# EAGLE design usbpropicprog-v2 (EAGLE 7.2.0)
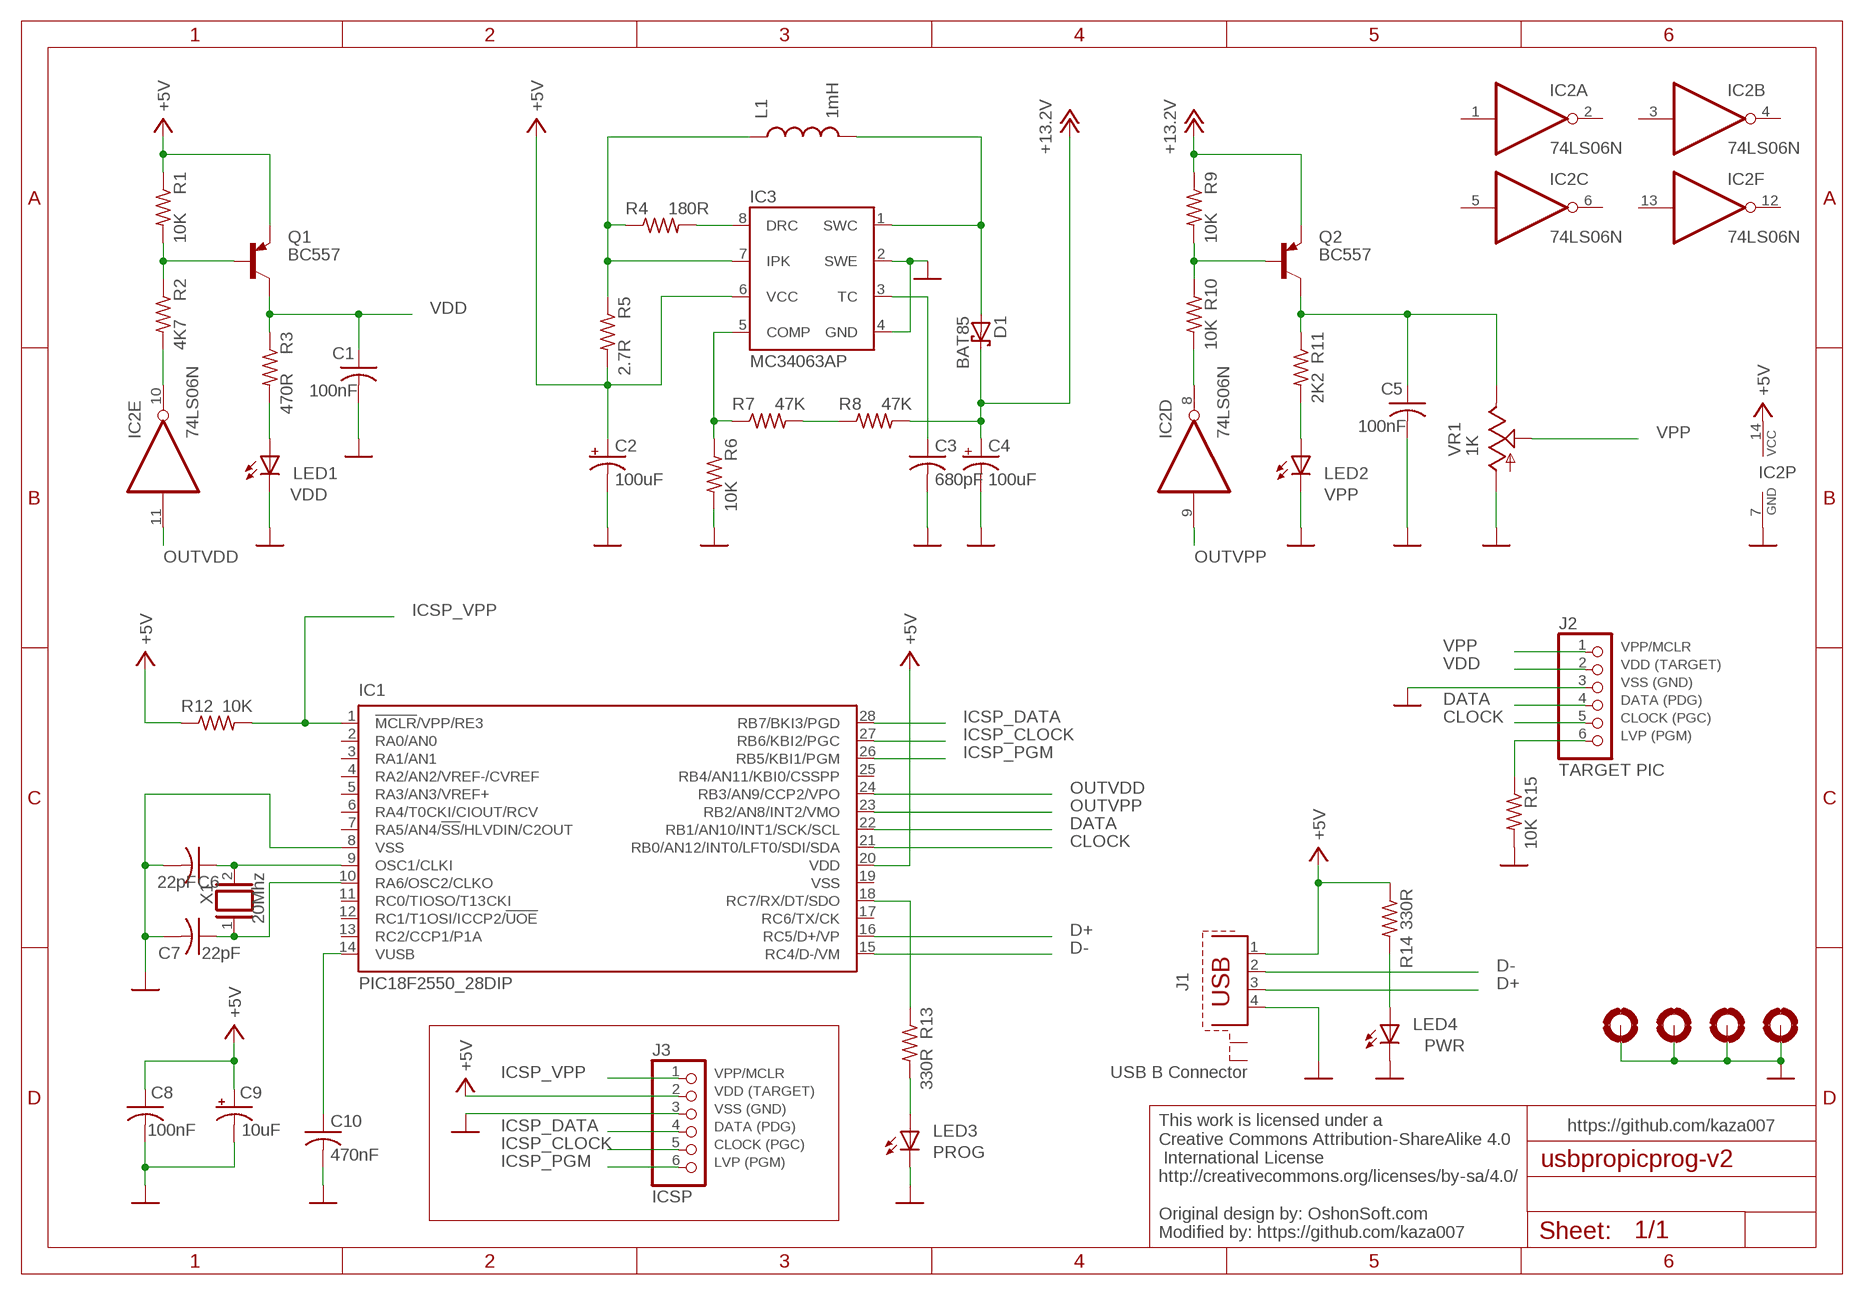
[diagram p0: schematic, sheet 1]

## Parts
C1  100nF  C-US050-025X075  [C050-025X075]
C2  100uF  POL-CAP-USE2,5-6,3  [E2,5-6,3]
C3  680pF  C-US050-025X075  [C050-025X075]
C4  100uF  POL-CAP-USE2,5-6,3  [E2,5-6,3]
C5  100nF  C-US050-025X075  [C050-025X075]
C6  22pF  C-US025-024X044  [C025-024X044]
C7  22pF  C-US025-024X044  [C025-024X044]
C8  100nF  C-US050-025X075  [C050-025X075]
C9  10uF  CPOL-USE2-5  [E2-5]
C10  470nF  C-US050-035X075  [C050-035X075]
D1  BAT85  1N5819-T  [DO41-7.6]
H1  MOUNT-PAD-ROUND2.8  [2,8-PAD]
H2  MOUNT-PAD-ROUND2.8  [2,8-PAD]
H3  MOUNT-PAD-ROUND2.8  [2,8-PAD]
H4  MOUNT-PAD-ROUND2.8  [2,8-PAD]
IC1  PIC18F2550_28DIP  [DIL28-3]
IC2  74LS06N  [DIL14]
IC3  MC34063AP  [DIL-08]
J1  USB B Connector  PN61729-S  [PN61729-S]
J2  TARGET PIC  PINHD-1X6  [1X06]
J3  ICSP  PINHD-1X6  [1X06]
L1  1mH  INDUCTORRLB0912  [RLB0912]
LED1  VDD  LED5MM  [LED5MM]
LED2  VPP  LED5MM  [LED5MM]
LED3  PROG  LED5MM  [LED5MM]
LED4  PWR  LED5MM  [LED5MM]
Q1  BC557  [TO92-EBC]
Q2  BC557  [TO92-EBC]
R1  10K  R-US_0207/10  [0207/10]
R2  4K7  R-US_0207/10  [0207/10]
R3  470R  R-US_0207/10  [0207/10]
R4  180R  R-US_0207/10  [0207/10]
R5  2.7R  R-US_0207/10  [0207/10]
R6  10K  R-US_0207/10  [0207/10]
R7  47K  R-US_0207/10  [0207/10]
R8  47K  R-US_0207/10  [0207/10]
R9  10K  R-US_0207/10  [0207/10]
R10  10K  R-US_0207/10  [0207/10]
R11  2K2  R-US_0207/10  [0207/10]
R12  10K  R-US_0207/10  [0207/10]
R13  330R  R-US_0207/10  [0207/10]
R14  330R  R-US_0207/10  [0207/10]
R15  10K  R-US_0207/10  [0207/10]
VR1  1K  R-TRIMM_US  [R-TRIMMT93YA]
X1  20Mhz  XTAL/S  [QS]

## Nets
+5V: C2.+ C8.1 C9.+ IC1.20(VDD) IC2.14(P:VCC) IC3.6(VCC) J1.1 J3.2 Q1.E R1.1 R5.2 R12.1 R14.1
+12V: C4.+ D1.C Q2.E R8.2 R9.1 ; supply symbol labelled +13.2V
CLOCK: IC1.21(RB0/AN12/INT0/LFT0/SDI/SDA) J2.5
D+: IC1.16(RC5/D+/VP) J1.3
D-: IC1.15(RC4/D-/VM) J1.2
DATA: IC1.22(RB1/AN10/INT1/SCK/SCL) J2.4
GND: C1.2 C2.- C3.2 C4.- C5.2 C6.2 C7.2 C8.2 C9.- C10.2 H1.B2,8(MOUNT) H2.B2,8(MOUNT) H3.B2,8(MOUNT) H4.B2,8(MOUNT) IC1.8(VSS) IC2.7(P:GND) IC3.2(SWE) IC3.4(GND) J1.4 J2.3 J3.3 LED1.K(C) LED2.K(C) LED3.K(C) LED4.K(C) R6.2 R15.2 VR1.3(A)
ICSP_CLOCK: IC1.27(RB6/KBI2/PGC) J3.5
ICSP_DATA: IC1.28(RB7/BKI3/PGD) J3.4
ICSP_PGM: IC1.26(RB5/KBI1/PGM) J3.6
ICSP_VPP: IC1.1(!MCLR!/VPP/RE3) J3.1 R12.2
N$1: IC1.18(RC7/RX/DT/SDO) R13.1
N$2: LED3.A R13.2
N$3: R7.2 R8.1
N$5: J2.6 R15.1
N$6: LED4.A R14.2
N$14: Q1.B R1.2 R2.1
N$15: Q2.B R9.2 R10.1
N$16: IC3.8(DRC) R4.2
N$17: LED1.A R3.2
N$18: IC3.7(IPK) L1.1 R4.1 R5.1
N$19: IC2.10(E:O) R2.2
N$20: LED2.A R11.2
N$21: C6.1 IC1.9(OSC1/CLKI) X1.2
N$22: C10.1 IC1.14(VUSB)
N$23: IC2.8(D:O) R10.2
N$25: D1.A IC3.1(SWC) L1.2
N$28: C3.1 IC3.3(TC)
N$29: IC3.5(COMP) R6.1 R7.1
N$34: C7.1 IC1.10(RA6/OSC2/CLKO) X1.1
OUTVDD: IC1.24(RB3/AN9/CCP2/VPO) IC2.11(E:I)
OUTVPP: IC1.23(RB2/AN8/INT2/VMO) IC2.9(D:I)
VDD: C1.1 J2.2 Q1.C R3.1
VPP: J2.1 VR1.2(S)
VPPHIGH: C5.1 Q2.C R11.1 VR1.1(E)
Unconnected: IC1.2(RA0/AN0) IC1.3(RA1/AN1) IC1.4(RA2/AN2/VREF-/CVREF) IC1.5(RA3/AN3/VREF+) IC1.6(RA4/T0CKI/CIOUT/RCV) IC1.7(RA5/AN4/!SS!/HLVDIN/C2OUT) IC1.11(RC0/TIOSO/T13CKI) IC1.12(RC1/T1OSI/ICCP2/!UOE) IC1.13(RC2/CCP1/P1A) IC1.17(RC6/TX/CK) IC1.25(RB4/AN11/KBI0/CSSPP) IC2.1(A:I) IC2.2(A:O) IC2.3(B:I) IC2.4(B:O) IC2.5(C:I) IC2.6(C:O) IC2.12(F:O) IC2.13(F:I) J1.S1 J1.S2

## Notes on the sheet
- VPP/MCLR
- VDD (TARGET)
- VSS (GND)
- DATA (PDG)
- CLOCK (PGC)
- LVP (PGM)
- VPP/MCLR
- VDD (TARGET)
- VSS (GND)
- DATA (PDG) | https://github.com/kaza007
- CLOCK (PGC)
- LVP (PGM)
- This work is licensed under a 
  Creative Commons Attribution-ShareAlike 4.0
   International License
  http://creativecommons.org/licenses/by-sa/4.0/
  
  Original design by: OshonSoft.com
  Modified by: https://github.com/kaza007

## Power pins joined to a net without a drawn wire
VSS: IC1.19(VSS)

## Library data of the parts
C1 C3 C5-C8 C10 = rcl:C-US: CAPACITOR, American symbol
C2 C4 = arthur:POL-CAP-US
C9 = rcl:CPOL-US: POLARIZED CAPACITOR, American symbol
D1 = diode:1N581*: 1.0A SCHOTTKY BARRIER RECTIFIER Source: http://www.diodes.com/datasheets/ds23001.pdf
H1-H4 = holes:MOUNT-PAD-ROUND: MOUNTING PAD, round
IC1 = microchip:PIC18F2*_28: USB Microcontrollers with nanoWatt Technology High-Performance, Enhanced Flash, 28/40/44-Pin, Source: http://ww1.microchip.com/downloads/en/devicedoc/39632c.pdf; MF: MICROCHIP; MPN: PIC18F2550-I/SP; OC_FARNELL: 1523822; OC_NEWARK: 80K6054
IC2 = 74xx-eu:74*06: Hex INVERTER, open collector high-voltage output
IC3 = v-reg-3:MC34063A: 1.5A Step-Up/Down/Inverting Switching Regulator NPN Darlington Switch, Vin 3V to 40V, Current Limiter Input, adjustable Frequency up to 100kHz
J1 = con-berg:PN61729-S: BERG USB connector; OC_FARNELL: unknown; OC_NEWARK: unknown
J2 J3 = pinhead:PINHD-1X6: PIN HEADER
L1 = kaza007:INDUCTOR: Inductors Basic Inductor/Choke - 0603 and 1206. Footprints are not proven and vary greatly between part numbers.
LED1-LED4 = led:LED: LED OSRAM: - CHIPLED LG R971, LG N971, LY N971, LG Q971, LY Q971, LO R971, LY R971 LH N974, LH R974 LS Q976, LO Q976, LY Q976 LO Q996 - Hyper CHIPLED LW Q18S LB Q993, LB Q99A, LB R99A - SideLED LS A670, LO A670, LY A670, LG A670, LP A670 LB A673, LV A673, LT A673, LW A673 LH A674 LY A675 LS A676, LA A676, LO A676, LY A676, LW A676 LS A679, LY A679, LG A679 - Hyper Micro SIDELED® LS Y876, LA Y876, LO Y876, LY Y876 LT Y87S - SmartLED LW L88C, LW L88S LB L89C, LB L89S, LG L890 LS L89K, LO L89K, LY L89K LS L896, LA L896, LO L896, LY L896 - TOPLED LS T670, LO T670, LY T670, LG T670, LP T670 LSG T670, LSP T670, LSY T670, LOP T670, LYG T670 LG T671, LOG T671, LSG T671 LB T673, LV T673, LT T673, LW T673 LH T674 LS T676, LA T676, LO T676, LY T676, LB T676, LH T676, LSB T676, LW T676 LB T67C, LV T67C, LT T67C, LS T67K, LO T67K, LY T67K, LW E67C LS E67B, LA E67B, LO E67B, LY E67B, LB E67C, LV E67C, LT E67C LW T67C LS T679, LY T679, LG T679 LS T770, LO T770, LY T770, LG T770, LP T770 LB T773, LV T773, LT T773, LW T773 LH T774 LS E675, LA E675, LY E675, LS T675 LS T776, LA T776, LO T776, LY T776, LB T776 LHGB T686 LT T68C, LB T68C - Hyper Mini TOPLED® LB M676 - Mini TOPLED Santana® LG M470 LS M47K, LO M47K, LY M47K Source: http://www.osram.convergy.de LUXEON: - LUMILED® LXK2-PW12-R00, LXK2-PW12-S00, LXK2-PW14-U00, LXK2-PW14-V00 LXK2-PM12-R00, LXK2-PM12-S00, LXK2-PM14-U00 LXK2-PE12-Q00, LXK2-PE12-R00, LXK2-PE12-S00, LXK2-PE14-T00, LXK2-PE14-U00 LXK2-PB12-K00, LXK2-PB12-L00, LXK2-PB12-M00, LXK2-PB14-N00, LXK2-PB14-P00, LXK2-PB14-Q00 LXK2-PR12-L00, LXK2-PR12-M00, LXK2-PR14-Q00, LXK2-PR14-R00 LXK2-PD12-Q00, LXK2-PD12-R00, LXK2-PD12-S00 LXK2-PH12-R00, LXK2-PH12-S00 LXK2-PL12-P00, LXK2-PL12-Q00, LXK2-PL12-R00 Source: www.luxeon.com KINGBRIGHT: KA-3528ASYC Source: www.kingbright.com
Q1 Q2 = transistor-pnp:BC557*: PNP Transistror
R1-R15 = resistor:R-US_: RESISTOR, American symbol
VR1 = arthur:R-TRIMM_US: R-TRIMMER Block Trimmer with adjustment screw on top.
X1 = special:XTAL/S: CRYSTAL

## Board
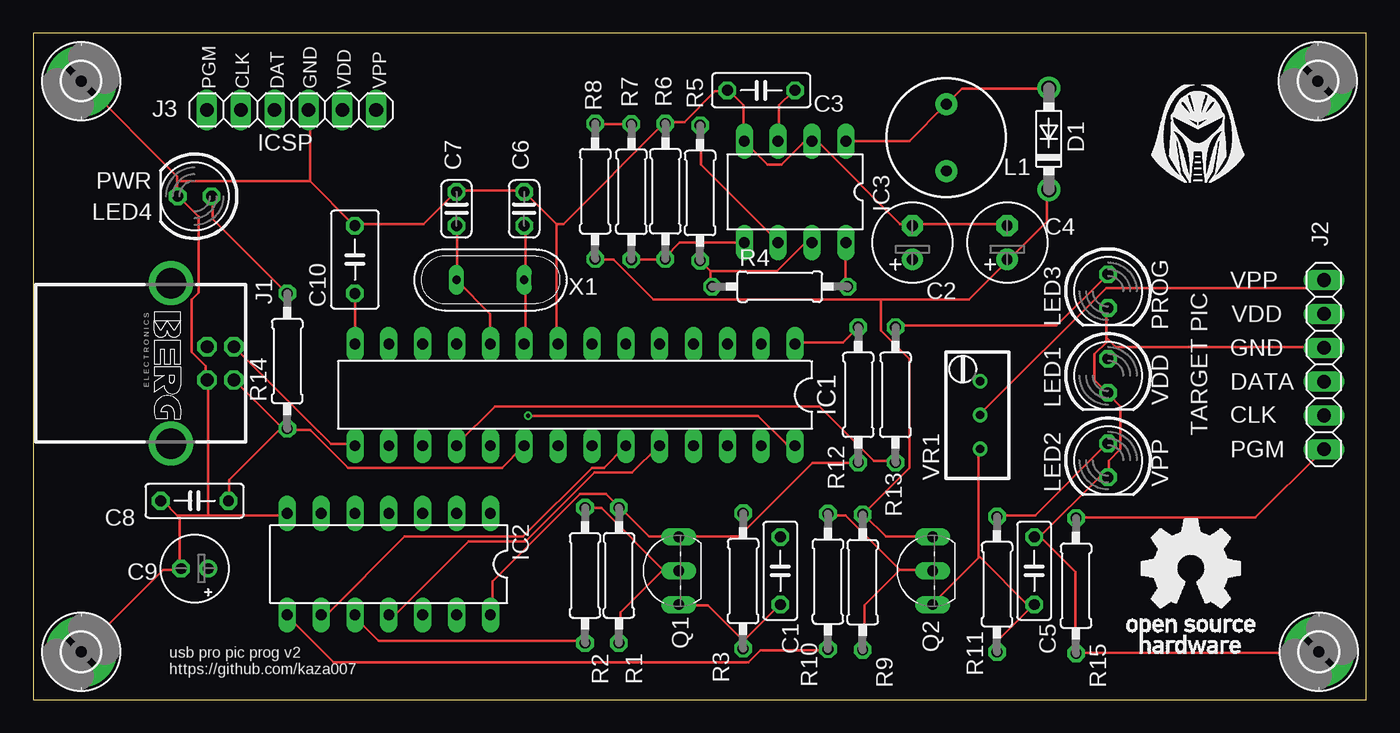
[diagram p1: board, top side]
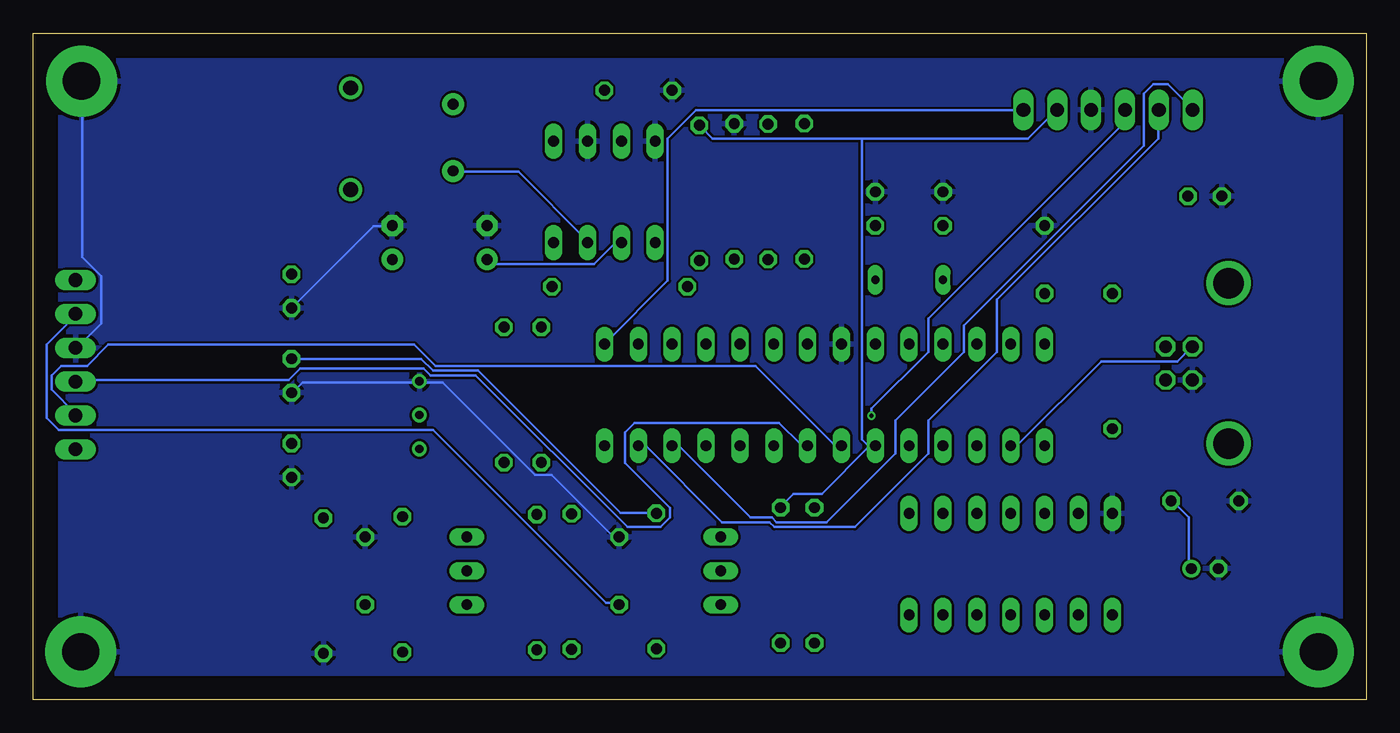
[diagram p2: board, bottom side, seen from below]

Size 100 x 50 mm. Coordinates in mm from the lower left corner, seen from the top.
Outline: 0,0 100,0 100,50 0,50 0,0
Copper layers (1*16): Top 0.035mm / dielectric 1.5mm / Bottom 0.035mm
Design rules "ShenZhen2U EagleRules": minimum track width 7mil, minimum drill 12mil, track to track 7mil, track to pad 7mil, pad to pad 7mil, via to via 7mil, smd to smd 0mil, copper to edge 20mil, drill to drill 10mil, minimum pad ring 10mil, minimum via ring 6mil, stop-mask expansion 2mil, vias tented up to drill 25mil, thermal gap 10mil

### Footprints (pad centres in the part's own frame; a part is rotated, then mirrored left to right if it is on the bottom)
C050-025X075 = drill 0.813 octagon: 1 -2.54,0; 2 2.54,0
E2,5-6,3 = drill 0.813 pad 1.6: + -1.27,0 | drill 0.813 pad 1.6 octagon: - 1.27,0
C025-024X044 = drill 0.813 octagon: 1 -1.27,0; 2 1.27,0
E2-5 = drill 0.813 pad 1.27: + -1.016,0 | drill 0.813 pad 1.27 octagon: - 1.016,0
C050-035X075 = drill 0.813 octagon: 1 -2.54,0; 2 2.54,0
DO41-7.6 = drill 1.1 pad 1.7: A 3.81,0; C -3.81,0
2,8-PAD = drill 2.8 pad 5.334: B2,8 0,0
DIL28-3 = drill 0.813 long: 1 -16.51,-3.81; 2 -13.97,-3.81; 3 -11.43,-3.81; 4 -8.89,-3.81; 5 -6.35,-3.81; 6 -3.81,-3.81; 7 -1.27,-3.81; 8 1.27,-3.81; 9 3.81,-3.81; 10 6.35,-3.81; 11 8.89,-3.81; 12 11.43,-3.81; 13 13.97,-3.81; 14 16.51,-3.81; 15 16.51,3.81; 16 13.97,3.81; 17 11.43,3.81; 18 8.89,3.81; 19 6.35,3.81; 20 3.81,3.81; 21 1.27,3.81; 22 -1.27,3.81; 23 -3.81,3.81; 24 -6.35,3.81; 25 -8.89,3.81; 26 -11.43,3.81; 27 -13.97,3.81; 28 -16.51,3.81
DIL14 = drill 0.813 long: 1 -7.62,-3.81; 2 -5.08,-3.81; 3 -2.54,-3.81; 4 0,-3.81; 5 2.54,-3.81; 6 5.08,-3.81; 7 7.62,-3.81; 8 7.62,3.81; 9 5.08,3.81; 10 2.54,3.81; 11 0,3.81; 12 -2.54,3.81; 13 -5.08,3.81; 14 -7.62,3.81
DIL-08 = drill 0.813 long: 1 -3.81,-3.81; 2 -1.27,-3.81; 3 1.27,-3.81; 4 3.81,-3.81; 5 3.81,3.81; 6 1.27,3.81; 7 -1.27,3.81; 8 -3.81,3.81
PN61729-S = drill 0.95 octagon: 1 1.25,4.71; 2 -1.25,4.71; 3 -1.25,2.71; 4 1.25,2.71 | drill 2.3 pad 2.9: S1 -6.02,0; S2 6.02,0
1X06 = drill 1.016 long: 1 -6.35,0; 2 -3.81,0; 3 -1.27,0; 4 1.27,0; 5 3.81,0; 6 6.35,0
RLB0912 = drill 0.813 pad 1.651: 1 2.502,0; 2 -2.502,0
LED5MM = drill 0.813 octagon: A -1.27,0; K 1.27,0
TO92-EBC = drill 0.813 long: B 0,-1.27; C -2.54,-1.27; E 2.54,-1.27
0207/10 = drill 0.813 octagon: 1 -5.08,0; 2 5.08,0
R-TRIMMT93YA = drill 0.61: 1 0,-2.54; 2 0,0; 3 0,2.54
QS = drill 0.61 long: 1 -2.54,0; 2 2.54,0

### Placement (x,y rotation side)
C1  56.05,9.66 90 top
C2  65.96,34.3 90 top
C3  54.61,45.72 180 top
C4  73.07,34.3 90 top
C5  75.1,9.66 90 top
C6  36.83,36.83 90 top
C7  31.75,36.83 90 top
C8  12.1,14.91 180 top
C9  12.1,9.83 180 top
C10  24.13,33.02 90 top
D1  76.19,42.08 90 top
H1  3.58,46.42 0 top
H2  3.58,3.58 0 top
H3  96.38,46.42 0 top
H4  96.45,3.58 0 top
IC1  40.64,22.86 180 top
IC2  26.67,10.16 180 top
IC3  57.15,38.1 180 top
J1  10.33,25.23 270 top
J2  96.83,25.13 270 top
J3  19.37,44.25 180 top
L1  68.5,42.17 270 top
LED1  80.63,24.3 270 top
LED2  80.63,17.95 270 top
LED3  80.63,30.65 270 top
LED4  12.1,37.77 180 top
Q1  47.16,9.66 90 top
Q2  66.21,9.66 90 top
R1  43.93,9.31 270 top
R2  41.39,9.31 270 top
R3  53.26,8.9 90 top
R4  56.01,30.99 0 top
R5  50.03,38.02 90 top
R6  47.42,38.14 90 top
R7  44.87,38.11 90 top
R8  42.16,38.14 270 top
R9  62.22,8.81 270 top
R10  59.62,8.86 270 top
R11  72.31,8.64 90 top
R12  61.89,22.87 90 top
R13  64.69,22.87 90 top
R14  19.05,25.4 90 top
R15  78.23,8.54 270 top
VR1  71.04,21.34 0 top
X1  34.29,31.5 0 top

### Tracks (layer width: path | path; a pad name or v marks a point on that pad's centre or on a via)
+5V
  Top 0.178: R5.2 50.09,42.99 50.09,40.15 55.78,34.46 IC3.6 | 18.62,20.41 18.98,20.41 R14.1 | 18.62,20.41 15.07,23.96 J1.1 | 18.62,20.41 14.71,16.5 14.71,15.07 C8.1 | 18.62,20.41 R14.1 | IC2.14 34.45,6.36 34.45,8.85 41.03,15.43 42.98,15.43 43.87,14.54 R1.1 44.05,14.36 46.18,12.23 48.32,12.23 Q1.E 48.49,12.23 52.94,12.23 58.45,17.74 61.83,17.74 R12.1 | R14.1 19.16,20.23 20.76,20.23 23.6,17.39 35.16,17.39 36.76,18.99 IC1.20
  Bottom 0.178: IC3.6 55.96,34.28 56.32,34.28 57.92,32.68 65.74,32.68 65.92,32.86 C2.+ | 37.83,42.1 49.03,42.1 49.92,42.99 R5.2 | 37.83,42.1 25.38,42.1 23.25,44.23 J3.2 | C9.+ 13.29,9.92 13.29,13.65 14.53,14.9 C8.1 | 37.29,18.99 36.94,18.99 IC1.20 37.29,18.99 | 37.29,18.99 40.85,15.43 42.98,15.43 43.87,14.54 R1.1 | 37.83,42.1 37.83,19.52 37.29,18.99
+12V
  Top 0.178: Q2.E 67.34,12.23 63.96,12.23 62.36,13.83 R9.1 62.36,14.01 65.74,17.39 65.74,25.57 63.61,27.7 63.61,30.01 | 63.61,30.01 70.18,30.01 73.03,32.86 C4.+ 73.21,33.03 76.05,35.88 76.05,38.19 D1.C | 63.61,30.01 46.54,30.01 43.52,33.03 42.27,33.03 R8.2
CLOCK
  Bottom 0.178: IC1.21 39.43,19.16 39.96,19.16 45.83,25.03 69.83,25.03 71.43,26.63 94.37,26.63 95.97,25.03 97.92,25.03 98.63,24.32 98.63,23.25 96.85,21.48 J2.5
D+
  Bottom 0.178: IC1.16 26.62,19.16 26.09,19.16 19.87,25.39 14.18,25.39 13.11,26.45 J1.3
D-
  Top 0.178: IC1.15 23.96,19.16 22.36,19.16 15.07,26.45 J1.2
DATA
  Bottom 0.178: IC1.22 41.91,19.16 42.45,19.16 44.05,20.77 54.89,20.77 55.61,20.05 55.61,17.74 52.23,14.36 52.23,13.65 52.94,12.94 55.43,12.94 66.81,24.32 70.18,24.32 70.72,24.85 79.96,24.85 80.85,23.96 96.68,23.96 J2.4
GND
  Top 0.178: 10.8,13.83 9.73,14.9 C8.2 | 10.8,13.83 10.98,13.65 10.98,9.92 C9.- 10.98,9.74 9.73,9.74 3.69,3.7 H2.B2,8 | 10.8,13.83 13.11,13.83 | 13.11,13.83 18.98,13.83 IC2.7 | 13.11,13.83 13.11,23.96 J1.4 12.93,24.14 12.93,25.03 11.87,26.1 11.87,30.01 12.4,30.54 12.4,36.23 10.98,37.66 LED4.K 10.8,37.83 10.8,38.9 | 10.8,38.9 10.8,39.26 3.69,46.37 H1.B2,8 | 39.25,35.7 39.25,26.81 IC1.8 | 39.25,35.7 36.94,38.01 C6.2 36.76,38.19 31.78,38.19 C7.2 31.6,38.01 29.29,35.7 24.14,35.7 C10.2 23.96,35.7 20.76,38.9 | 20.76,38.9 20.76,44.23 J3.3 | 20.76,38.9 10.8,38.9 | 75.52,12.23 75.16,12.23 C5.2 75.52,12.23 | 75.52,12.23 79.96,16.68 80.5,16.68 LED2.K 80.67,16.85 80.67,17.92 81.56,18.81 81.56,22.01 80.67,22.9 LED1.K 80.5,23.08 79.61,23.96 79.61,25.92 80.5,26.81 80.5,27.16 | 75.52,12.23 78.19,9.56 78.19,3.52 R15.2 78.36,3.52 96.32,3.52 H4.B2,8 | C4.- 73.03,35.7 66.1,35.7 C2.- 65.92,35.7 65.03,35.7 58.98,41.75 58.45,41.75 IC3.2 58.27,41.75 57.74,41.75 56.14,40.15 55.07,40.15 53.47,41.75 IC3.4 53.29,41.92 53.29,44.59 52.23,45.66 C3.2 52.05,45.66 51.16,45.66 48.85,43.35 47.43,43.35 R6.2 47.25,43.17 39.78,35.7 39.25,35.7 | 80.5,27.16 80.5,29.3 LED3.K | 80.5,27.16 81.21,26.45 96.68,26.45 J2.3
  Bottom 0.178: LED1.K 80.5,23.08 79.79,23.79 71.07,23.79 VR1.3 70.9,23.79 69.3,23.79 62.36,16.85 61.12,16.85 56.49,12.23 56.14,12.23 C1.2 | C4.- 73.21,35.52 74.45,35.52 80.5,29.48 LED3.K | H3.B2,8 96.32,46.37 96.32,33.21 94.9,31.79 94.9,28.23 96.68,26.45 J2.3
  pour Bottom: 1.95,1.96 1.95,47.96 97.95,47.96 97.95,1.96
ICSP_CLOCK
  Bottom 0.178: IC1.27 54.54,18.99 54.01,18.99 48.32,13.3 44.76,13.3 44.4,12.94 38.36,12.94 32.85,18.45 32.85,20.94 27.69,26.1 27.69,30.01 15.6,42.1 15.6,44.23 J3.5
ICSP_DATA  (via drill 0.3)
  Top 0.178: v37.11,21.3 54.36,21.3 56.49,19.16 57.03,19.16 IC1.28
  Bottom 0.178: v37.11,21.3 37.11,21.83 32.85,26.1 32.85,28.59 18.27,43.17 18.27,44.23 J3.4
ICSP_PGM
  Bottom 0.178: IC1.26 52.05,18.99 51.52,18.99 46.18,13.65 44.58,13.65 44.23,13.3 40.49,13.3 35.34,18.45 35.34,20.94 30.18,26.1 30.18,28.05 16.67,41.57 16.67,45.48 15.96,46.19 14.89,46.19 13.11,44.41 J3.6
ICSP_VPP
  Top 0.178: IC1.1 57.21,26.81 60.76,26.81 61.83,27.88 R12.2
  Bottom 0.178: J3.1 25.73,44.23 50.27,44.23 52.41,42.1 52.41,31.43 57.03,26.81 IC1.1
N$1
  Top 0.178: R13.1 64.67,17.92 63.07,17.92 58.98,22.01 34.62,22.01 31.78,19.16 IC1.18
N$2
  Top 0.178: R13.2 64.85,28.05 76.76,28.05 80.5,31.79 LED3.A
N$3
  Top 0.178: R7.2 44.76,43.17 42.27,43.17 R8.1
N$5
  Top 0.178: R15.1 78.36,13.65 91.7,13.65 96.68,18.63 J2.6
N$6
  Top 0.178: LED4.A 13.47,37.66 13.47,36.06 18.98,30.54 R14.2
N$14
  Top 0.178: 47.25,9.74 42.63,14.36 41.56,14.36 R2.1 | 47.25,9.74 48.32,9.74 Q1.B 47.25,9.74 | 47.25,9.74 44.05,6.54 44.05,4.41 R1.2
N$15
  Top 0.178: 65.03,9.74 60.94,13.83 59.7,13.83 R10.1 | 65.03,9.74 67.34,9.74 Q2.B | 65.03,9.74 62.36,7.07 62.36,3.87 R9.2
N$16
  Top 0.178: IC3.8 60.94,34.28 60.94,31.08 R4.2
N$17
  Bottom 0.178: R3.2 53.29,14.01 55.96,14.01 66.63,24.68 70.01,24.68 70.9,25.57 80.5,25.57 LED1.A
N$18
  Top 0.178: 50.8,32.14 50.8,31.08 R4.1 | 50.8,32.14 50.09,32.86 R5.1 | 50.8,32.14 55.78,32.14 57.92,34.28 58.27,34.28 IC3.7
  Bottom 0.178: L1.1 68.41,39.61 63.61,39.61 58.45,34.46 IC3.7
N$19
  Top 0.178: R2.2 41.38,4.41 25.91,4.41 24.14,6.18 IC2.10
N$20
  Top 0.178: R11.2 72.32,13.83 75.16,13.83 80.5,19.16 LED2.A
N$21
  Top 0.178: C6.1 36.94,35.52 36.94,31.61 X1.2 36.94,31.43 36.94,26.81 IC1.9
N$22
  Top 0.178: IC1.14 24.14,26.81 24.14,30.37 C10.1
N$23
  Top 0.178: R10.2 59.52,3.7 54.54,3.7 53.65,2.81 22.54,2.81 19.16,6.18 IC2.8
N$25
  Top 0.178: IC3.1 61.12,41.92 65.74,41.92 68.41,44.59 L1.2 68.58,44.77 69.65,45.83 76.05,45.83 D1.A
N$28
  Top 0.178: IC3.3 55.96,41.92 55.96,44.59 57.03,45.66 C3.1
N$29
  Top 0.178: R7.1 44.94,33.03 47.25,33.03 R6.1 47.43,33.21 48.49,34.28 53.29,34.28 IC3.5
N$34
  Top 0.178: C7.1 31.78,35.52 31.78,31.61 X1.1 31.78,31.43 34.27,28.94 34.27,26.81 IC1.10
OUTVDD
  Top 0.178: IC2.11 26.8,6.36 27.16,6.36 32.67,11.88 36.94,11.88 42.09,17.03 44.94,17.03 46.89,18.99 IC1.24
OUTVPP
  Top 0.178: IC2.9 21.65,6.36 22,6.36 27.87,12.23 36.76,12.23 41.91,17.39 42.8,17.39 44.4,18.99 IC1.23
VDD
  Top 0.178: 53.29,4.41 53.29,3.87 R3.1 53.29,4.41 | 53.29,4.41 55.96,7.07 C1.1 | 53.29,4.41 50.63,7.07 48.49,7.07 Q1.C
  Bottom 0.178: J2.2 96.85,28.77 98.99,26.63 98.99,21.12 98.1,20.23 70.01,20.23 57.03,7.25 56.14,7.25 C1.1
VPP
  Top 0.178: VR1.2 71.07,21.48 80.5,30.9 96.14,30.9 96.68,31.43 J2.1
VPPHIGH
  Top 0.178: 74.81,6.9 74.99,7.07 C5.1 74.81,6.9 | 74.81,6.9 72.32,4.41 72.32,3.7 R11.1 | 70.9,10.81 70.9,10.63 67.52,7.25 Q2.C | 70.9,10.81 70.9,18.63 VR1.1 | 70.9,10.81 74.81,6.9

### Text on the board
tPlace: PGM | CLK | DAT | GND | VDD | VPP | VPP | VDD | GND | DATA | CLK | PGM | usb pro pic prog v2 / https://github.com/kaza007